# Altium schematic sheet Micro Controller.SchDoc
size A4; SheetNumber: 4; SheetTotal: 6
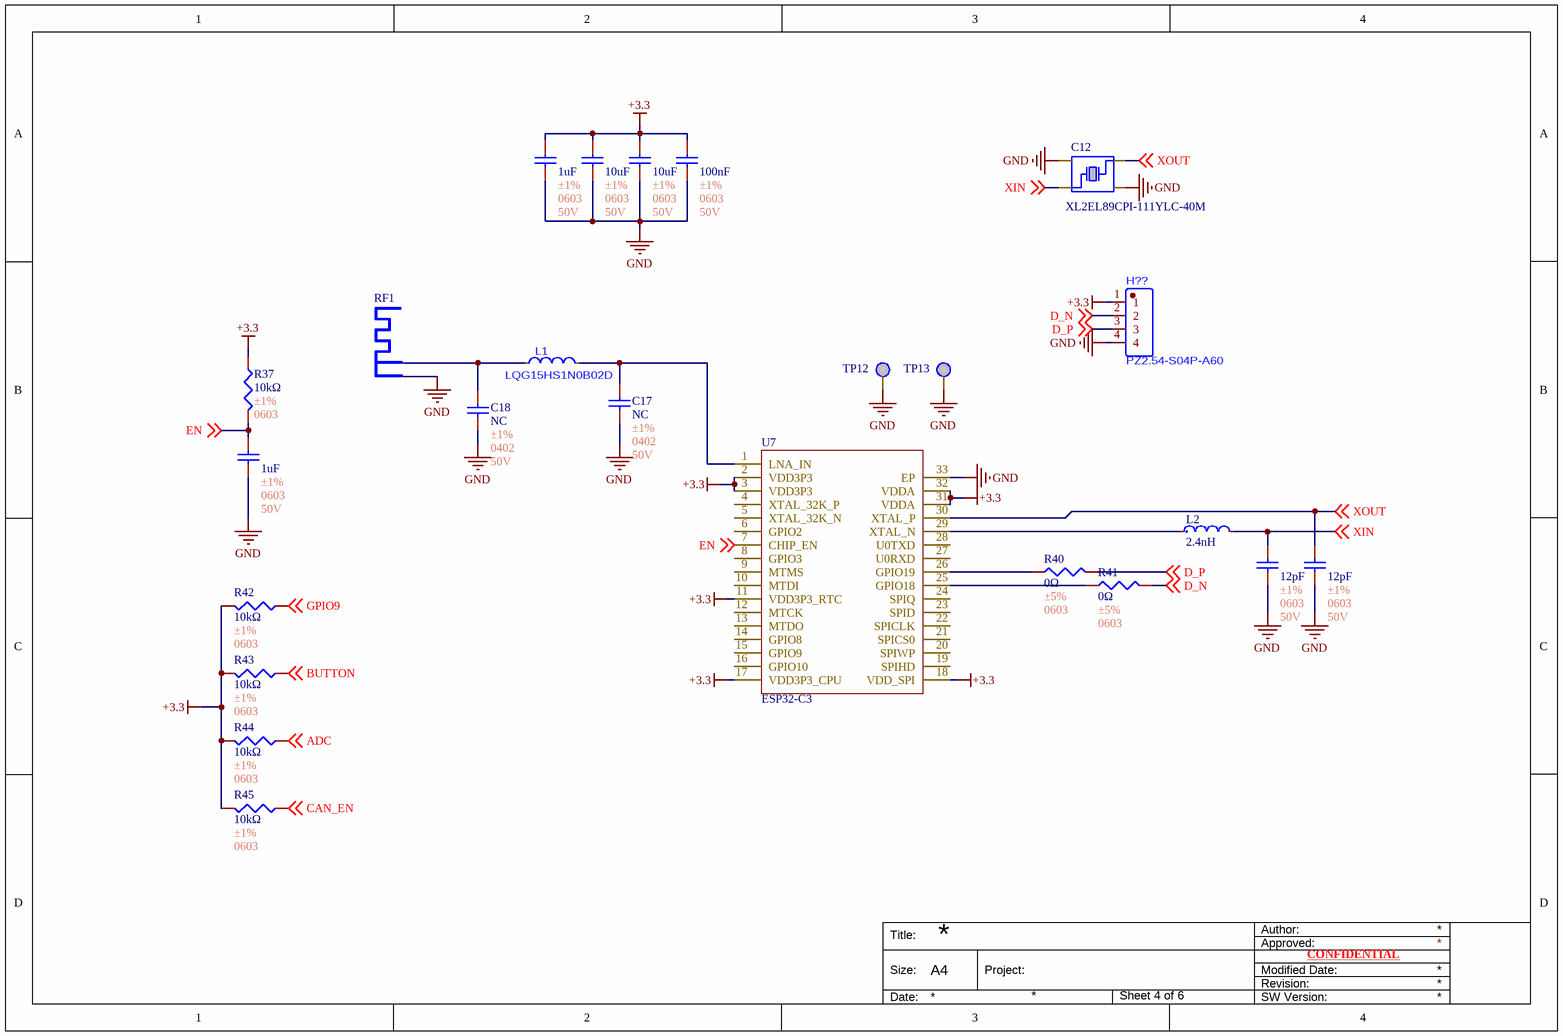
[diagram p0: Micro Controller.SchDoc]

## Parts
C12  XL2EL89CPI-111YLC-40M  [XL2EL89CPI-111YLC-40M]
C13  1uF  Tolerance: ±1%  Package: 0603  Voltage Rating: 50V  [C0603]
C14  10uF  Tolerance: ±1%  Package: 0603  Voltage Rating: 50V  [C0603]
C15  10uF  Tolerance: ±1%  Package: 0603  Voltage Rating: 50V  [C0603]
C16  100nF  Tolerance: ±1%  Package: 0603  Voltage Rating: 50V  [C0603]
C17  NC  Tolerance: ±1%  Package: 0402  Voltage Rating: 50V  [C0402]
C18  NC  Tolerance: ±1%  Package: 0402  Voltage Rating: 50V  [C0402]
C19  1uF  Tolerance: ±1%  Package: 0603  Voltage Rating: 50V  [C0603]
C20  12pF  Tolerance: ±1%  Package: 0603  Voltage Rating: 50V  [C0603]
C21  12pF  Tolerance: ±1%  Package: 0603  Voltage Rating: 50V  [C0603]
H??  PZ2.54-S04P-A60  [J_4P_XH2.54]
L1  LQG15HS1N0B02D  [L0402_1nH]
L2  2.4nH
R37  10kΩ  Tolerance: ±1%  Package: 0603  [R0603]
R40  0Ω  Tolerance: ±5%  Package: 0603  [R0603]
R41  0Ω  Tolerance: ±5%  Package: 0603  [R0603]
R42  10kΩ  Tolerance: ±1%  Package: 0603  [R0603]
R43  10kΩ  Tolerance: ±1%  Package: 0603  [R0603]
R44  10kΩ  Tolerance: ±1%  Package: 0603  [R0603]
R45  10kΩ  Tolerance: ±1%  Package: 0603  [R0603]
RF1  (no value)  [2.4GHZ-50OHMS_v1.1]
TP12  TP  [TP]  (value not drawn)
TP13  TP  [TP]  (value not drawn)
U7  ESP32-C3  [ESP32-C3]

## Nets
+3.3: C13.1 C14.1 C15.1 C16.1 H??.1 R37.1 R42.2 R43.2 R44.2 R45.2 U7.2(VDD3P3) U7.3(VDD3P3) U7.11(VDD3P3_RTC) U7.17(VDD3P3_CPU) U7.18(VDD_SPI) U7.31(VDDA) U7.32(VDDA)
GND: C12.2 C12.4 C13.2 C14.2 C15.2 C16.2 C17.2 C18.2 C19.2 C20.2 C21.2 H??.4 RF1.2 TP12.1 TP13.1 U7.33(EP)
ADC: R44.1 ; off-sheet ADC
BUTTON: R43.1 ; off-sheet BUTTON
CAN_EN: R45.1 ; off-sheet CAN_EN
D_N: H??.2 R41.2 ; off-sheet D_N
D_P: H??.3 R40.2 ; off-sheet D_P
EN: C19.1 R37.2 U7.7(CHIP_EN) ; off-sheet EN
GPIO9: R42.1 ; off-sheet GPIO9
XIN: C12.1 C20.1 L2.2 ; off-sheet XIN
XOUT: C12.3 C21.1 U7.30(XTAL_P) ; off-sheet XOUT
NetC17_1: C17.1 L1.2 U7.1(LNA_IN)
NetC18_1: C18.1 L1.1 RF1.1
NetL2_1: L2.1 U7.29(XTAL_N)
NetR40_1: R40.1 U7.26(GPIO19)
NetR41_1: R41.1 U7.25(GPIO18)

Not connected (* = marked no-connect by the designer): U7 4(XTAL_32K_P) 5(XTAL_32K_N) 6(GPIO2) 8(GPIO3) 9(MTMS) 10(MTDI) 12(MTCK) 13(MTDO) 14(GPIO8) 15(GPIO9) 16(GPIO10) 19(SPIHD) 20(SPIWP) 21(SPICS0) 22(SPICLK) 23(SPID) 24(SPIQ) 27(U0RXD) 28(U0TXD)

## Notes on the sheet
- Author:
- Title:
- Size:
- A4
- Project:
- Approved:
- Revision:
- Modified Date:
- CONFIDENTIAL
- Date:
- SW Version:

## Library data of the parts
C12 = XL2EL89CPI-111YLC-40M: Crystal Oscillator 15pF SMD3225-4P Crystals RoHS; Manufacturer: YXC Crystal Oscillators; Mfr. Part #: XL2EL89CPI-111YLC-40M; LCSC Part #: C5444549; Package: SMD3225-4P; Link: https://www.lcsc.com/product-detail/C5444549.html?s_z=n_oscillator; Key Attributes: Crystal Oscillator 15pF SMD3225-4P Crystals RoHS
C13 C19 = C0603_1uF_±1%: 50V 10pF NP0 ±1% 0402 Multilayer Ceramic Capacitors MLCC - SMD/SMT ROHS; Manufacturer: YAGEO; Mfr. Part #: CC0402FRNPO9BN100; LCSC Part #: C513681; Link: https://www.lcsc.com/product-detail/C513681.html?s_z=n_capital%2520yageo%252010pF%25200402; Capacitance: 1uF
C14 C15 = C0603_10uF_±1%: 50V 10pF NP0 ±1% 0402 Multilayer Ceramic Capacitors MLCC - SMD/SMT ROHS; Manufacturer: YAGEO; Mfr. Part #: CC0402FRNPO9BN100; LCSC Part #: C513681; Link: https://www.lcsc.com/product-detail/C513681.html?s_z=n_capital%2520yageo%252010pF%25200402; Capacitance: 10uF
C16 = C0603_100nF_±1%: 50V 10pF NP0 ±1% 0402 Multilayer Ceramic Capacitors MLCC - SMD/SMT ROHS; Manufacturer: YAGEO; Mfr. Part #: CC0402FRNPO9BN100; LCSC Part #: C513681; Link: https://www.lcsc.com/product-detail/C513681.html?s_z=n_capital%2520yageo%252010pF%25200402; Capacitance: 100nF
C17 C18 = C0402_NC_±1%: Manufacturer: YAGEO; Mfr. Part #: CC0402FRNPO9BN100; Capacitance: 1uF; LCSC Part #: C513681; Link: https://www.lcsc.com/product-detail/C513681.html?s_z=n_capital%2520yageo%252010pF%25200402
C20 C21 = C0603_12pF_±1%: 50V 10pF NP0 ±1% 0402 Multilayer Ceramic Capacitors MLCC - SMD/SMT ROHS; Manufacturer: YAGEO; Mfr. Part #: CC0402FRNPO9BN100; LCSC Part #: C513681; Link: https://www.lcsc.com/product-detail/C513681.html?s_z=n_capital%2520yageo%252010pF%25200402; Capacitance: 12pF
H?? = J_4P_XH2.54: 1kV 1 2.54mm Pin Header 3A 2.5mm Through Hole 6mm -40℃~+105℃ 3mm Gold 4P Black 1x4P Through Hole,P=2.54mm Headers, Male Pins RoHS; Manufacturer: JXTCONN; MPN: PZ2.54-S04P-A60; LCSC Part #: C42431795; Packaging: Through Hole,P=2.54mm; Link: https://www.lcsc.com/product-detail/C42431795.html?s_z=n_q_t_header%25204%2520p&spm=wm.fly.bg.0.xh___wm.ssy.tc.0.tz&lcsc_vid=FlRcBlcDRFNZAlJQT1RZBVJSEVFcX11eRVQPBFEHFgAxVlNeQVVcV1RRRlFeUzsOAxUeFF5JWBYZEEoKFBINSQcJGk4dAgUUFAk%3D
L1 = L0402_1nH: FIXED IND 1nH 1A 70mΩ 0402; Manufacturer: muRata; MPN: LQG15HS1N0B02D; LCSC Part #: C162538; Packaging: 0402; Link: https://www.lcsc.com/product-detail/C162538.html?s_z=n_q_0402%2520inductor%25201nH&spm=wm.fly.bg.1.xh&lcsc_vid=FFlaVlZURFlbX1EAE1lbUlZfQwdeBlBRQ1VZBFdQQwUxVlNeQ1FfVlBVRFlZVjsOAxUeFF5JWBYZEEoKFBINSQcJGk4NBhADEA4cHktXRllfSQwSGg0%3D
L2 = L_0402_24nH: FIXED IND 24nH 350mA 430mΩ 0402; Manufacturer: TDK; Mfr. Part #: MLG1005S24NHTD25; LCSC Part #: C404641; Package: 0402; Link: https://www.lcsc.com/product-detail/C404641.html?s_z=n_q_inductor%252024nH&spm=wm.fly.bg.1.xh&lcsc_vid=FlRcBlcDRFNZAlJQT1RZBVJSEVFcX11eRVQPBFEHFgAxVlNeQVVfX11XQFdfVzsOAxUeFF5JWBYZEEoKFBINSQcJGk4NBhADEA4cHktTQlhADxALGw%3D%3D; Inductance: 2.4nH
R37 R42-R45 = R0603_10kΩ_±1%: 62.5mW Thick Film Resistor 50V ±1% ±200ppm/℃ 10Ω 0402 Chip Resistor - Surface Mount ROHS; Manufacturer: YAGEO; Mfr. Part #: RC0402FR-0710RL; LCSC Part #: C138066; Resistance: 10kΩ; Link: https://www.lcsc.com/product-detail/C138066.html?s_z=n_resistor%25200402%252010R
R40 R41 = R0603_0Ω_±5%: 100mW Thick Film Resistor 75V ±5% 0Ω 0603 Chip Resistor - Surface Mount ROHS; Manufacturer: YAGEO; Mfr. Part #: RC0603JR-070RL; Key Attributes: RES 0Ω ±5% 100mW 0603; LCSC Part #: C95177; Resistance: 0Ω; Link: https://www.lcsc.com/product-detail/C138066.html?s_z=n_resistor%25200402%252010R
RF1 = Antenna
U7 = ESP32-C3: Others 160MHz QFN-32-EP(5x5) RF Transceiver Modules and Modems RoHS; Manufacturer: ESPRESSIF; LCSC Part #: C2838500; Package: QFN-32-EP(5x5); Link: https://www.lcsc.com/product-detail/C2838500.html?s_z=n_ESP32%2520C3; MPN: ESP32-C3